# Altium project proj.prjpcb
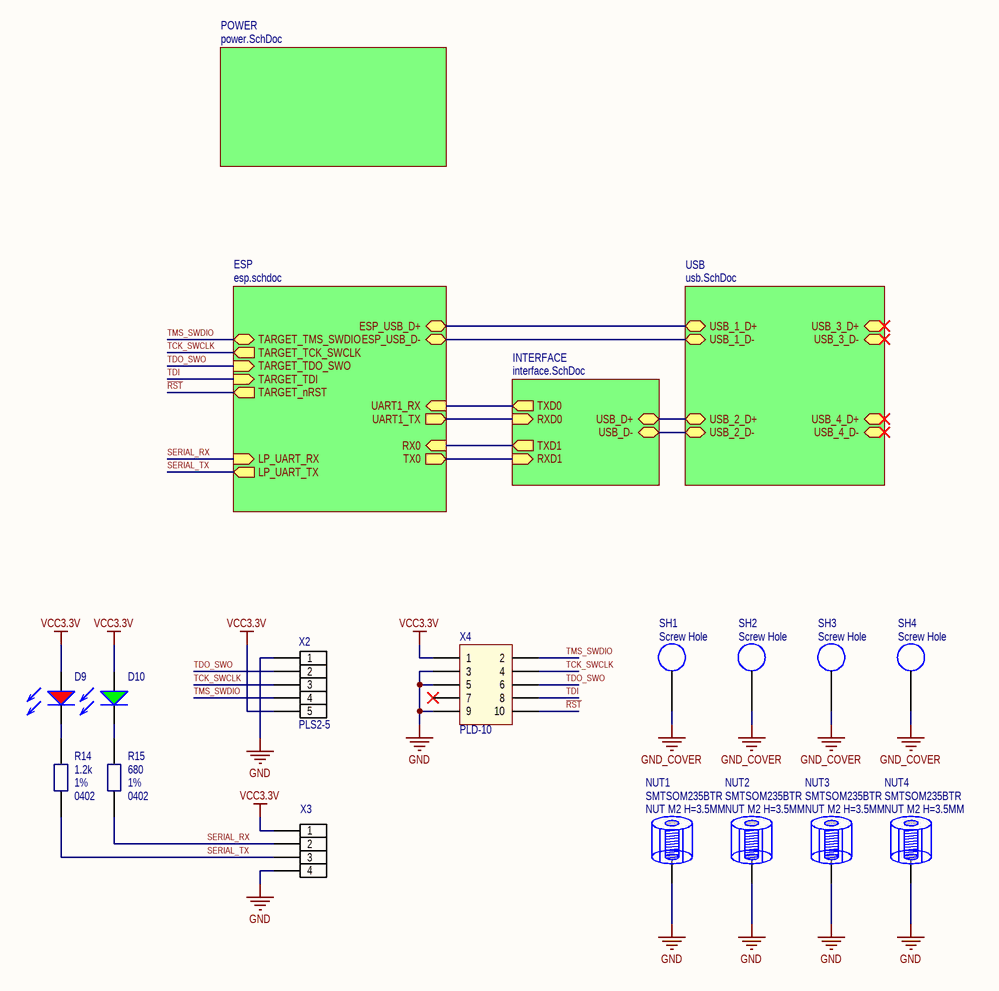
[diagram p0: sch.SchDoc]
5 sheets, 54 parts. Net scope: hierarchical (ports join the sheet entries above them; power ports are global).
Board file: pcb.pcbdoc
Sheets:
  sch.SchDoc
    ESP = esp.schdoc
    USB = usb.SchDoc
    POWER = power.SchDoc
    INTERFACE = interface.SchDoc

## Sheet sch.SchDoc
size 209 x 297 mm

### Parts
D9  Red 645nm  [LED 0603 RED, 60°]  (value not drawn)
D10  Emerald Green 515nm  [LED 0603 GREEN, 60°]  (value not drawn)
NUT1  SMTSOM235BTR  Case/Package: NUT M2 H=3.5MM  [SMTSOM235BTR]
NUT2  SMTSOM235BTR  Case/Package: NUT M2 H=3.5MM  [SMTSOM235BTR]
NUT3  SMTSOM235BTR  Case/Package: NUT M2 H=3.5MM  [SMTSOM235BTR]
NUT4  SMTSOM235BTR  Case/Package: NUT M2 H=3.5MM  [SMTSOM235BTR]
R14  value 1.2k  Case/Package: 0402  Tolerance: 1%  [R_0402]  (hidden comment: R0402)
R15  value 680  Case/Package: 0402  Tolerance: 1%  [R_0402]  (hidden comment: R0402)
SH1  Screw Hole  [Screw Hole 2.1mm/4.2mm]  (no BOM)
SH2  Screw Hole  [Screw Hole 2.1mm/4.2mm]  (no BOM)
SH3  Screw Hole  [Screw Hole 2.1mm/4.2mm]  (no BOM)
SH4  Screw Hole  [Screw Hole 2.1mm/4.2mm]  (no BOM)
X2  PLS2-5  [PLS-5T]
X3  PLS2-4  [PLS-4T]  (value not drawn)
X4  PLD-10  [PLD-10T]  (no BOM)

### Sub-sheets
ESP = esp.schdoc: TX0 (out), RX0 (in), LP_UART_TX (out), LP_UART_RX (in), ESP_USB_D+ (bidir), ESP_USB_D- (bidir), TARGET_TMS_SWDIO (bidir), TARGET_TCK_SWCLK (out), TARGET_TDO_SWO (in), TARGET_TDI (in), TARGET_nRST (out), UART1_TX (out), UART1_RX (in)
INTERFACE = interface.SchDoc: RXD0 (in), TXD0 (out), USB_D+ (bidir), USB_D- (bidir), TXD1 (out), RXD1 (in)
POWER = power.SchDoc: no entries
USB = usb.SchDoc: USB_3_D+ (bidir), USB_3_D- (bidir), USB_1_D+ (bidir), USB_1_D- (bidir), USB_2_D+ (bidir), USB_2_D- (bidir), USB_4_D+ (bidir), USB_4_D- (bidir)

### Nets
GND: NUT1.1(M3) NUT2.1(M3) NUT3.1(M3) NUT4.1(M3) X2.1 X3.4 X4.3 X4.5 X4.9
GND_COVER: SH1.1 SH2.1 SH3.1 SH4.1
VCC3.3V: D9.2 D10.2 X2.5 X3.1 X4.1
~{RST}: X4.10 ; sheet ESP/TARGET_nRST
SERIAL_RX: R15.1 X3.2 ; sheet ESP/LP_UART_RX
SERIAL_TX: R14.1 X3.3 ; sheet ESP/LP_UART_TX
TCK_SWCLK: X2.3 X4.4 ; sheet ESP/TARGET_TCK_SWCLK
TDI: X4.8 ; sheet ESP/TARGET_TDI
TDO_SWO: X2.2 X4.6 ; sheet ESP/TARGET_TDO_SWO
TMS_SWDIO: X2.4 X4.2 ; sheet ESP/TARGET_TMS_SWDIO
USB_1_N: sheet ESP/ESP_USB_D-, sheet USB/USB_1_D-
USB_1_P: sheet ESP/ESP_USB_D+, sheet USB/USB_1_D+
USB_2_N: sheet USB/USB_2_D-, sheet INTERFACE/USB_D-
USB_2_P: sheet USB/USB_2_D+, sheet INTERFACE/USB_D+
NetD9_1: D9.1 R14.2
NetD10_1: D10.1 R15.2
NetU1_11: sheet ESP/UART1_RX, sheet INTERFACE/TXD0
NetU1_12: sheet ESP/UART1_TX, sheet INTERFACE/RXD0
NetU1_24: sheet ESP/RX0, sheet INTERFACE/TXD1
NetU1_25: sheet ESP/TX0, sheet INTERFACE/RXD1

Not connected (* = marked no-connect by the designer): X4 7*

### Library data of the parts
D9 = RED-LED-0603: RED LED 0603, 60°; Part: APTD1608LSURCK; Color: Red 645nm; Alternative Part: *
D10 = GREEN LED 0603: GREEN LED 0603, 60°; Part: APTD1608ZGC; Alternative Part: *; Color: Emerald Green 515nm
NUT1-NUT4 = SMTSOM235BTR: NUT M2 H=3.5MM, Connector Standoff; Manufacturer: Sinhoo; Verified by ME: NO; Part: SMTSOM235BTR; Alternative Part: *; Pins: 1
R14 = R0402: Resistor; Part: RC0402FR-071K2L; Alternative Part: *
R15 = R0402: Resistor; Part: RC0402FR-07680RL; Alternative Part: *
X2 = PLS2-5: Header, 5-Pin; Part: X6511WRS-05H-C60D48; LatestRevisionDate: 17-Jul-2002; LatestRevisionNote: Re-released for DXP Platform.; Publisher: Altium Limited
X3 = PLS2-4: Header, 4-Pin; Part: X6511WRS-04H-C60D48; LatestRevisionDate: 17-Jul-2002; LatestRevisionNote: Re-released for DXP Platform.; Publisher: Altium Limited
X4 = PLD-10: male; PIN: 10; 2.54mm; Part: *
SH1-SH4 = Screw Hole: Pin Count: 1; Internal_PN: -

## Sheet esp.schdoc
size 209 x 297 mm; PageSetup: Record=PageOptions|CenterHorizontal=False|CenterVertical=False|PrintScale=0.95|XCorrection=0.00|YCorrection=0.00|PrintKind=1|BorderSize=5000000|LeftOffset=0|BottomOffset=0|Orientation=1|PaperLength=1000|PaperWidth=1000|Scale=100|PaperSource=15|PrintQuality=600|MediaType=1|DitherType=10|PaperKind=A4|PrintScaleMode=1
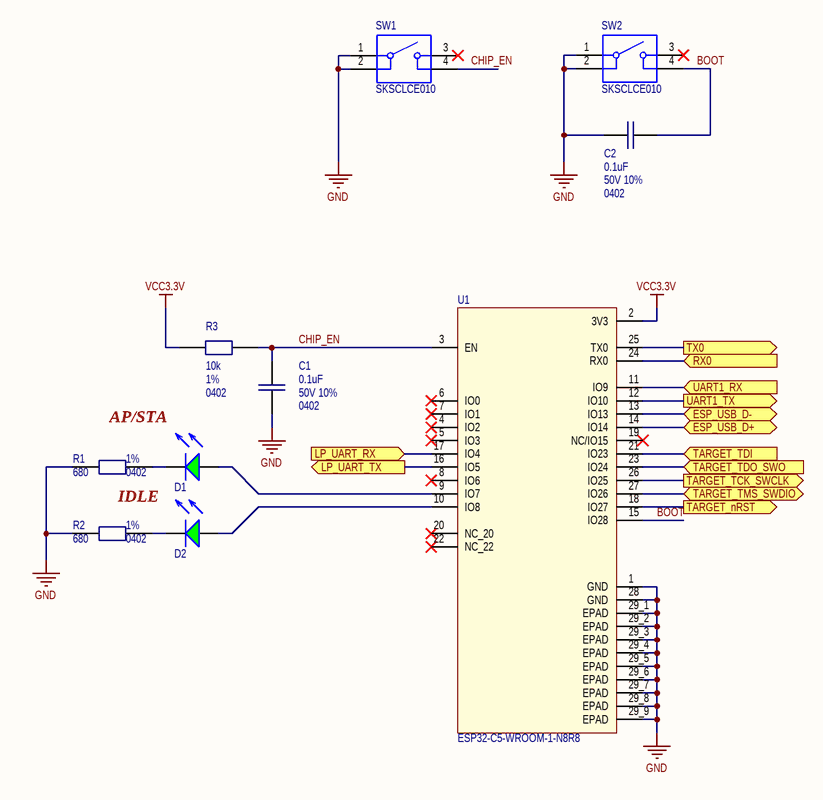
[diagram p1: esp.schdoc]

### Parts
C1  value 0.1uF  Case/Package: 0402  Tolerance: 50V 10%  [C_0402]  (hidden comment: C0402)
C2  value 0.1uF  Case/Package: 0402  Tolerance: 50V 10%  [C_0402]  (hidden comment: C0402)
D1  Emerald Green 515nm  [LED 0603 GREEN, 60°]  (value not drawn)
D2  Emerald Green 515nm  [LED 0603 GREEN, 60°]  (value not drawn)
R1  value 680  Case/Package: 0402  Tolerance: 1%  [R_0402]  (hidden comment: R0402)
R2  value 680  Case/Package: 0402  Tolerance: 1%  [R_0402]  (hidden comment: R0402)
R3  value 10k  Case/Package: 0402  Tolerance: 1%  [R_0402]  (hidden comment: R0402)
SW1  SKSCLCE010  [SKSCLCE010-Footprint-1]
SW2  SKSCLCE010  [SKSCLCE010-Footprint-1]
U1  ESP32-C5-WROOM-1-N8R8  [XCVR_ESP32-C5-WROOM-1-N8R8]

### Ports
ESP_USB_D+ (bidir), ESP_USB_D- (bidir), LP_UART_RX (in), LP_UART_TX (out), RX0 (in), TARGET_nRST (out), TARGET_TCK_SWCLK (out), TARGET_TDI (in), TARGET_TDO_SWO (in), TARGET_TMS_SWDIO (bidir), TX0 (out), UART1_RX (in), UART1_TX (out)

### Nets
GND: C1.1 C2.2 R1.1 R2.1 SW1.1 SW1.2 SW2.1 SW2.2 U1.1(GND) U1.28(GND) U1.29_1(EPAD) U1.29_2(EPAD) U1.29_3(EPAD) U1.29_4(EPAD) U1.29_5(EPAD) U1.29_6(EPAD) U1.29_7(EPAD) U1.29_8(EPAD) U1.29_9(EPAD)
VCC3.3V: R3.1 U1.2(3V3)
~{RST}: U1.18(IO27) ; port TARGET_nRST
BOOT: C2.1 SW2.4 U1.15(IO28)
CHIP_EN: C1.2 R3.2 SW1.4 U1.3(EN)
SERIAL_RX: U1.17(IO4) ; port LP_UART_RX
SERIAL_TX: U1.16(IO5) ; port LP_UART_TX
TCK_SWCLK: U1.26(IO25) ; port TARGET_TCK_SWCLK
TDI: U1.21(IO23) ; port TARGET_TDI
TDO_SWO: U1.23(IO24) ; port TARGET_TDO_SWO
TMS_SWDIO: U1.27(IO26) ; port TARGET_TMS_SWDIO
USB_1_N: U1.13(IO13) ; port ESP_USB_D-
USB_1_P: U1.14(IO14) ; port ESP_USB_D+
NetD1_1: D1.1 R1.2
NetD1_2: D1.2 U1.9(IO7)
NetD2_1: D2.1 R2.2
NetD2_2: D2.2 U1.10(IO8)
NetU1_11: U1.11(IO9) ; port UART1_RX
NetU1_12: U1.12(IO10) ; port UART1_TX
NetU1_24: U1.24(RX0) ; port RX0
NetU1_25: U1.25(TX0) ; port TX0

Not connected (* = marked no-connect by the designer): SW1 3*; SW2 3*; U1 4(IO2)* 5(IO3)* 6(IO0)* 7(IO1)* 8(IO6)* 19(NC/IO15)* 20(NC_20)* 22(NC_22)*

### Notes on the sheet
- AP/STA
- IDLE

### Library data of the parts
C1 C2 = C0402: Capacitor; Part: CC0402KRX5R9BB104; Alternative Part: *
D1 D2 = GREEN LED 0603: GREEN LED 0603, 60°; Part: APTD1608ZGC; Alternative Part: *; Color: Emerald Green 515nm
R1 R2 = R0402: Resistor; Part: RC0402FR-07680RL; Alternative Part: *
R3 = R0402: Resistor; Part: RC0402FR-0710KL; Alternative Part: *
SW1 SW2 = SKSCLCE010: 2.9mm 1.25mm Rectangle button 50mA Surface Mount 3.5mm SPST 12V SMD Tactile Switches ROHS; Manufacturer: Alps Alpine; Verified by ME: YES; Voltage Rating: 12V; Alternative Part: *; Part: SKSCLCE010; Manufacturer_PN: SKSCLCE010; Pins: 4; Current Rating: 50mA; Case/Package: SKSCLCE010
U1 = ESP32-C5-WROOM-1-N8R8: 802.15.4, Bluetooth, WiFi 802.11b/g/n/ac/ax, Bluetooth v5.0, Thread, ZigbeeÂ® Transceiver Module 2.412GHz ~ 2.484GHz, 5.18GHz ~ 5.885GHz Antenna Not Included Surface Mount; MF: Espressif Systems; MP: ESP32-C5-WROOM-1U-N8R8; SnapEDA_Link: https://www.snapeda.com/parts/ESP32-C5-WROOM-1U-N8R8/Espressif+Systems/view-part/?ref=snap; Package: None; Value: *; Check_prices: https://www.snapeda.com/parts/ESP32-C5-WROOM-1U-N8R8/Espressif+Systems/view-part/?ref=eda; Part: ESP32-C5-WROOM-1-N8R8

## Sheet usb.SchDoc: {Наименование}
size 209 x 297 mm; DocumentNumber: {Обозначение}; SheetNumber: {}; SheetTotal: {}; PageSetup: Record=PageOptions|CenterHorizontal=False|CenterVertical=False|PrintScale=0.95|XCorrection=0.00|YCorrection=0.00|PrintKind=1|BorderSize=5000000|LeftOffset=0|BottomOffset=0|Orientation=1|PaperLength=1000|PaperWidth=1000|Scale=100|PaperSource=15|PrintQuality=600|MediaType=1|DitherType=10|PaperKind=A4|PrintScaleMode=1; Rule: PcbType=ProtelPcb
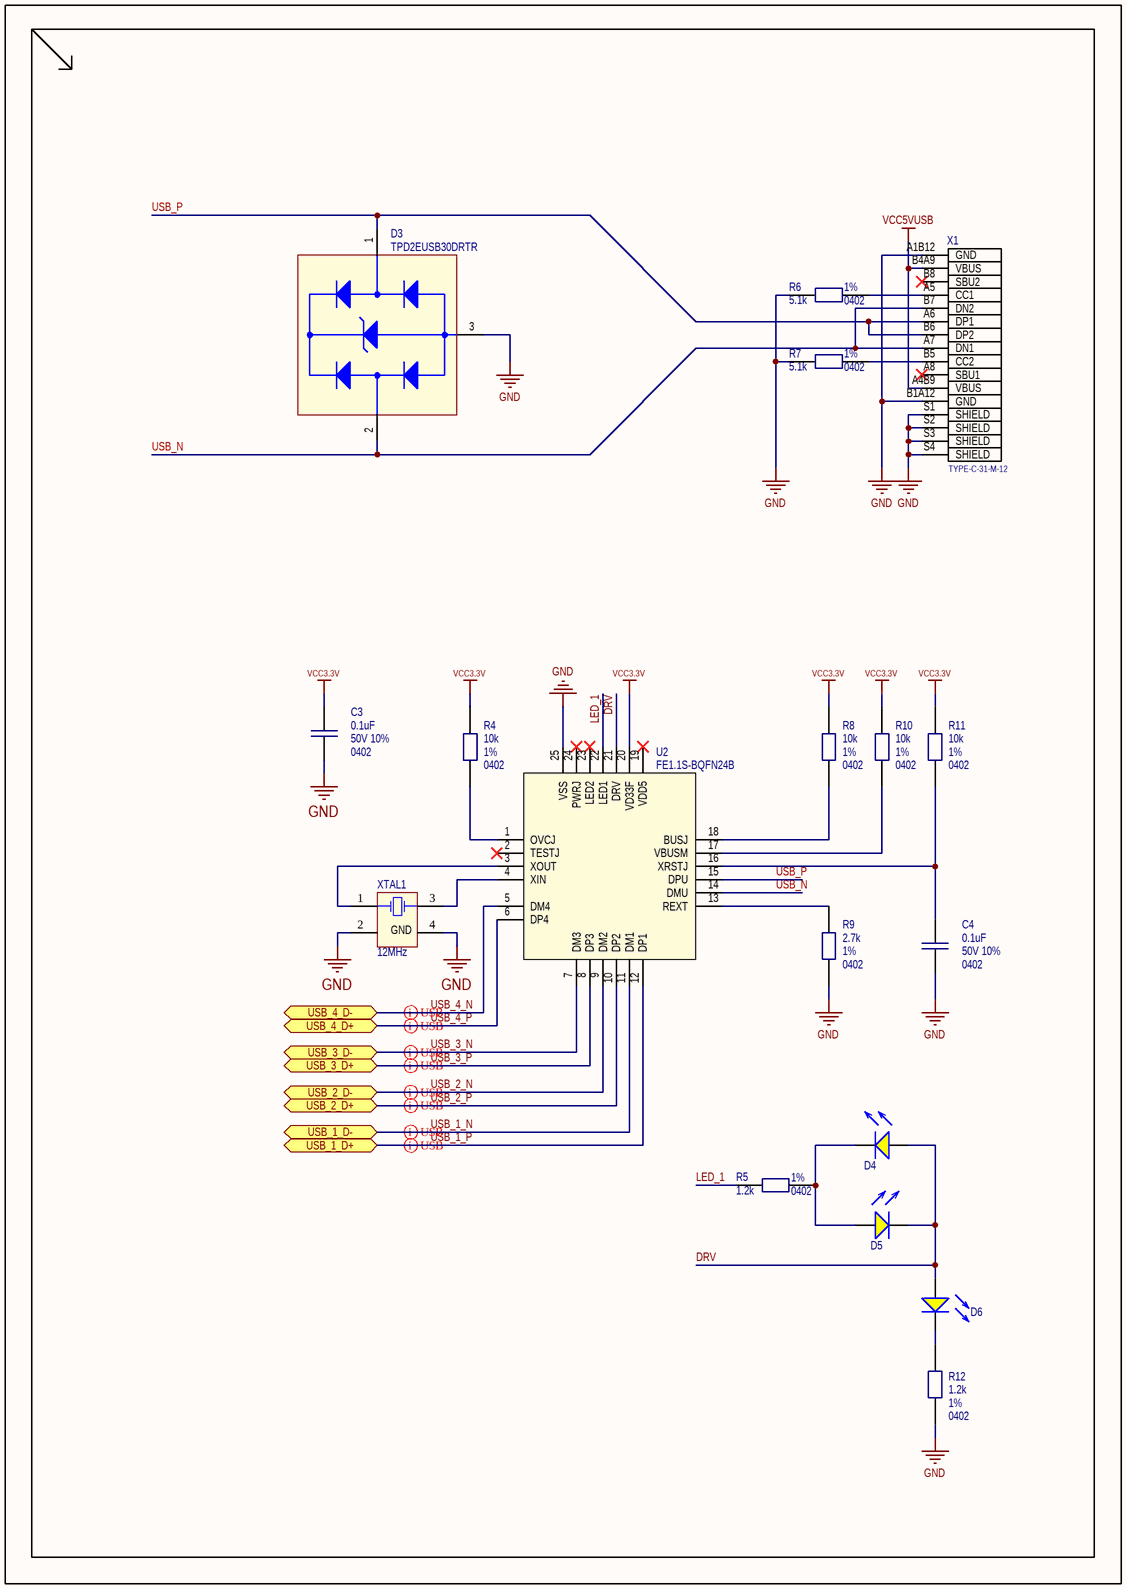
[diagram p2: usb.SchDoc]

### Parts
C3  value 0.1uF  Case/Package: 0402  Tolerance: 50V 10%  [C_0402]  (hidden comment: C0402)
C4  value 0.1uF  Case/Package: 0402  Tolerance: 50V 10%  [C_0402]  (hidden comment: C0402)
D3  TPD2EUSB30DRTR  [SOT-9X3-3]
D4  Yellow 590nm  [LED 0603 YELLOW, 60°]  (value not drawn)
D5  Yellow 590nm  [LED 0603 YELLOW, 60°]  (value not drawn)
D6  Yellow 590nm  [LED 0603 YELLOW, 60°]  (value not drawn)
R4  value 10k  Case/Package: 0402  Tolerance: 1%  [R_0402]  (hidden comment: R0402)
R5  value 1.2k  Case/Package: 0402  Tolerance: 1%  [R_0402]  (hidden comment: R0402)
R6  value 5.1k  Case/Package: 0402  Tolerance: 1%  [R_0402]  (hidden comment: R0402)
R7  value 5.1k  Case/Package: 0402  Tolerance: 1%  [R_0402]  (hidden comment: R0402)
R8  value 10k  Case/Package: 0402  Tolerance: 1%  [R_0402]  (hidden comment: R0402)
R9  value 2.7k  Case/Package: 0402  Tolerance: 1%  [R_0402]  (hidden comment: R0402)
R10  value 10k  Case/Package: 0402  Tolerance: 1%  [R_0402]  (hidden comment: R0402)
R11  value 10k  Case/Package: 0402  Tolerance: 1%  [R_0402]  (hidden comment: R0402)
R12  value 1.2k  Case/Package: 0402  Tolerance: 1%  [R_0402]  (hidden comment: R0402)
U2  FE1.1S-BQFN24B  [QFN50P400X400X80-25N-D]
X1  TYPE-C-31-M-12  [HRO_TYPE-C-31-M-12]
XTAL1  12MHz  [NX3225GA]

### Ports
USB_1_D+ (bidir), USB_1_D- (bidir), USB_2_D+ (bidir), USB_2_D- (bidir), USB_3_D+ (bidir), USB_3_D- (bidir), USB_4_D+ (bidir), USB_4_D- (bidir)

### Nets
GND: C3.1 C4.1 D3.3(I/O2_IN) R6.2 R7.2 R9.1 R12.2 U2.25(VSS) X1.A1B12(GND) X1.B1A12(GND) X1.S1(SHIELD) X1.S2(SHIELD) X1.S3(SHIELD) X1.S4(SHIELD) XTAL1.2(GND) XTAL1.4(GND)
VCC3.3V: C3.2 R4.2 R8.2 R10.2 R11.2 U2.20(VD33F)
VCC5VUSB: X1.A4B9(VBUS) X1.B4A9(VBUS)
DRV: D4.2 D5.1 D6.2 U2.21(DRV)
LED_1: R5.2 U2.22(LED1)
USB_1_N: U2.11(DM1) ; port USB_1_D-
USB_1_P: U2.12(DP1) ; port USB_1_D+
USB_2_N: U2.9(DM2) ; port USB_2_D-
USB_2_P: U2.10(DP2) ; port USB_2_D+
USB_3_N: U2.7(DM3) ; port USB_3_D-
USB_3_P: U2.8(DP3) ; port USB_3_D+
USB_4_N: U2.5(DM4) ; port USB_4_D-
USB_4_P: U2.6(DP4) ; port USB_4_D+
USB_N: D3.2(GND) U2.14(DMU) X1.A7(DN1) X1.B7(DN2)
USB_P: D3.1(I/O1_IN) U2.15(DPU) X1.A6(DP1) X1.B6(DP2)
NetC4_2: C4.2 R11.1 U2.16(XRSTJ)
NetD4_1: D4.1 D5.2 R5.1
NetD6_1: D6.1 R12.1
NetR4_1: R4.1 U2.1(OVCJ)
NetR6_1: R6.1 X1.A5(CC1)
NetR7_1: R7.1 X1.B5(CC2)
NetR8_1: R8.1 U2.18(BUSJ)
NetR9_2: R9.2 U2.13(REXT)
NetR10_1: R10.1 U2.17(VBUSM)
NetU2_3: U2.3(XOUT) XTAL1.1(OSC1)
NetU2_4: U2.4(XIN) XTAL1.3(OSC2)

Not connected (* = marked no-connect by the designer): U2 2(TESTJ)* 19(VDD5)* 23(LED2)* 24(PWRJ)*; X1 A8(SBU1)* B8(SBU2)*

### Layout directives
differential pair; net class USB_MCU; differential pair class USB: USB_2_N, USB_2_P, USB_3_N, USB_3_P, USB_4_N, USB_4_P
differential pair; net class USB_RLINK; differential pair class USB: USB_1_N, USB_1_P

### Library data of the parts
C3 C4 = C0402: Capacitor; Part: CC0402KRX5R9BB104; Alternative Part: *
D3 = TPD2EUSB30DRTR: 2-channel ESD solution for SuperSpeed USB 3.0 interface 3-SOT-9X3 -40 to 85; MF: Texas Instruments; Package: SOT-9X3-3 Texas Instruments; Purchase-URL: https://pricing.snapeda.com/search/part/TPD2EUSB30DRTR/?ref=eda; Value: *; MP: TPD2EUSB30DRTR; Availability: Warning; SnapEDA_Link: https://www.snapeda.com/parts/TPD2EUSB30DRTR/Texas%20Instruments/view-part/189118/?ref=snap; Price: None; Part: TPD2EUSB30DRTR
D4-D6 = YELLOW-LED-0603: YELLOW LED 0603, 60°; Part: APTD1608SYCK; Alternative Part: *; Color: Yellow 590nm
R4 R8 R10 R11 = R0402: Resistor; Part: RC0402FR-0710KL; Alternative Part: *
R5 R12 = R0402: Resistor; Part: RC0402FR-071K2L; Alternative Part: *
R6 R7 = R0402: Resistor; Part: RC0402FR-075K1L; Alternative Part: *
R9 = R0402: Resistor; Part: RC0402FR-072K7L; Alternative Part: *
U2 = FE1.1S-BQFN24B: USB 2.0 HIGH SPEED 4-PORT HUB CONTROLLER; Manufacturer_Name: Terminus Technology; Datasheet Link: https://datasheet.lcsc.com/lcsc/2306141021_Terminus-Tech-FE1-1S-BQFN24B_C6776948.pdf; Height: 0.8mm; Part: FE1.1S-BQFN24B; Alternative Part: *
X1 = TYPE-C-31-M-12: USB Connectors 24 Receptacle 1 8.94*7.3mm RoHS; Package: None; Availability: Unavailable; Value: *; MP: TYPE-C-31-M-12; Price: None; Part: TYPE-C-31-M-12; Alternative Part: *
XTAL1 = SMD3225-4P: Crystal Oscillator; Part: X322512MSB4SI; Alternative Part: *; Value: 12MHz

## Sheet power.SchDoc
size 209 x 297 mm
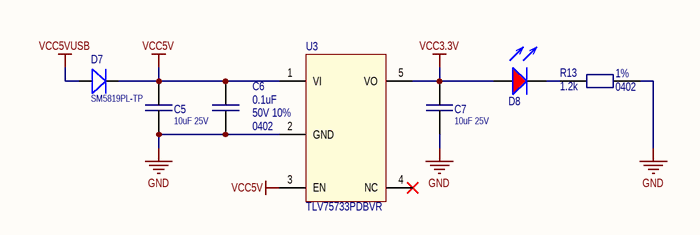
[diagram p3: power.SchDoc]

### Parts
C5  10uF 25V  [C_0603]
C6  value 0.1uF  Case/Package: 0402  Tolerance: 50V 10%  [C_0402]  (hidden comment: C0402)
C7  10uF 25V  [C_0603]
D7  SM5819PL-TP  [SOD123FL]
D8  Red 645nm  [LED 0603 RED, 60°]  (value not drawn)
R13  value 1.2k  Case/Package: 0402  Tolerance: 1%  [R_0402]  (hidden comment: R0402)
U3  TLV75733PDBVR  [SOT23-5]

### Nets
GND: C5.1 C6.1 C7.1 R13.1 U3.2(GND)
VCC3.3V: C7.2 D8.2 U3.5(VO)
VCC5V: C5.2 C6.2 D7.2(K) U3.1(VI) U3.3(EN)
VCC5VUSB: D7.1(A)
NetD8_1: D8.1 R13.2

Not connected (* = marked no-connect by the designer): U3 4(NC)*

### Library data of the parts
C5 C7 = C0603: Capacitor; Part: CC0603MRX5R8BB106; Value: 10uF 25V
C6 = C0402: Capacitor; Part: CC0402KRX5R9BB104; Alternative Part: *
D7 = D_SOD123: Diode; Part: SM5819PL-TP; Alternative Part: *
D8 = RED-LED-0603: RED LED 0603, 60°; Part: APTD1608LSURCK; Color: Red 645nm; Alternative Part: *
R13 = R0402: Resistor; Part: RC0402FR-071K2L; Alternative Part: *
U3 = TPL720F33-5TR: Ultra-Low Quiescent Current LDO; Part: TLV75733PDBVR

## Sheet interface.SchDoc
size 209 x 297 mm
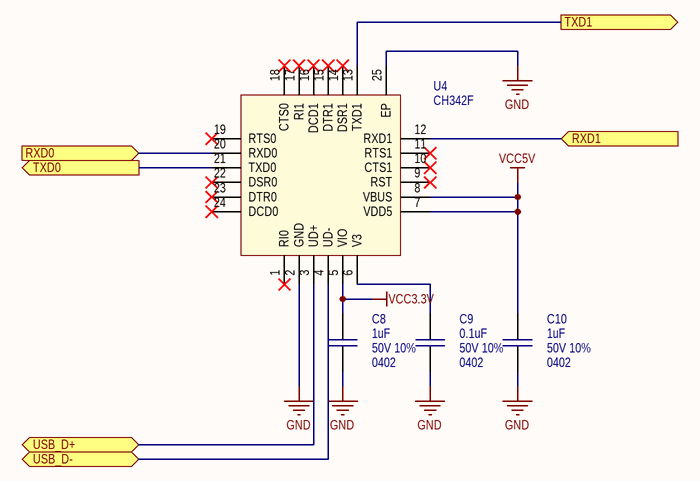
[diagram p4: interface.SchDoc]

### Parts
C8  value 1uF  Case/Package: 0402  Tolerance: 50V 10%  [C_0402]  (hidden comment: C0402)
C9  value 0.1uF  Case/Package: 0402  Tolerance: 50V 10%  [C_0402]  (hidden comment: C0402)
C10  value 1uF  Case/Package: 0402  Tolerance: 50V 10%  [C_0402]  (hidden comment: C0402)
U4  CH342F  [QFN50P400X400X80-25N-D]

### Ports
RXD0 (in), RXD1 (in), TXD0 (out), TXD1 (out), USB_D+ (bidir), USB_D- (bidir)

### Nets
GND: C8.1 C9.1 C10.1 U4.2(GND) U4.25(EP)
VCC3.3V: C8.2 U4.5(VIO)
VCC5V: C10.2 U4.7(VDD5) U4.8(VBUS)
USB_2_N: U4.4(UD-) ; port USB_D-
USB_2_P: U4.3(UD+) ; port USB_D+
NetC9_2: C9.2 U4.6(V3)
NetU1_11: U4.21(TXD0) ; port TXD0
NetU1_12: U4.20(RXD0) ; port RXD0
NetU1_24: U4.13(TXD1) ; port TXD1
NetU1_25: U4.12(RXD1) ; port RXD1

Not connected (* = marked no-connect by the designer): U4 1(RI0)* 9(RST)* 10(CTS1)* 11(RTS1)* 14(DSR1)* 15(DTR1)* 16(DCD1)* 17(RI1)* 18(CTS0)* 19(RTS0)* 22(DSR0)* 23(DTR0)* 24(DCD0)*

### Library data of the parts
C8 C10 = C0402: Capacitor; Part: CC0402KRX5R9BB105; Alternative Part: *
C9 = C0402: Capacitor; Part: CC0402KRX5R9BB104; Alternative Part: *
U4 = CH342F: Part: CH342F

## Nets that join several sheets
GND: sch (9 pins), esp (19 pins), usb (16 pins), power (5 pins), interface (5 pins)
VCC3.3V: sch (5 pins), esp (R3.1 U1.2), usb (6 pins), power (C7.2 D8.2 U3.5), interface (C8.2 U4.5)
VCC5V: power (5 pins), interface (C10.2 U4.7 U4.8)
VCC5VUSB: usb (X1.A4B9 X1.B4A9), power (D7.1)
~{RST}: sch (X4.10), esp (U1.18)
NetU1_11: esp (U1.11), interface (U4.21)
NetU1_12: esp (U1.12), interface (U4.20)
NetU1_24: esp (U1.24), interface (U4.13)
NetU1_25: esp (U1.25), interface (U4.12)
SERIAL_RX: sch (R15.1 X3.2), esp (U1.17)
SERIAL_TX: sch (R14.1 X3.3), esp (U1.16)
TCK_SWCLK: sch (X2.3 X4.4), esp (U1.26)
TDI: sch (X4.8), esp (U1.21)
TDO_SWO: sch (X2.2 X4.6), esp (U1.23)
TMS_SWDIO: sch (X2.4 X4.2), esp (U1.27)
USB_1_N: esp (U1.13), usb (U2.11)
USB_1_P: esp (U1.14), usb (U2.12)
USB_2_N: usb (U2.9), interface (U4.4)
USB_2_P: usb (U2.10), interface (U4.3)